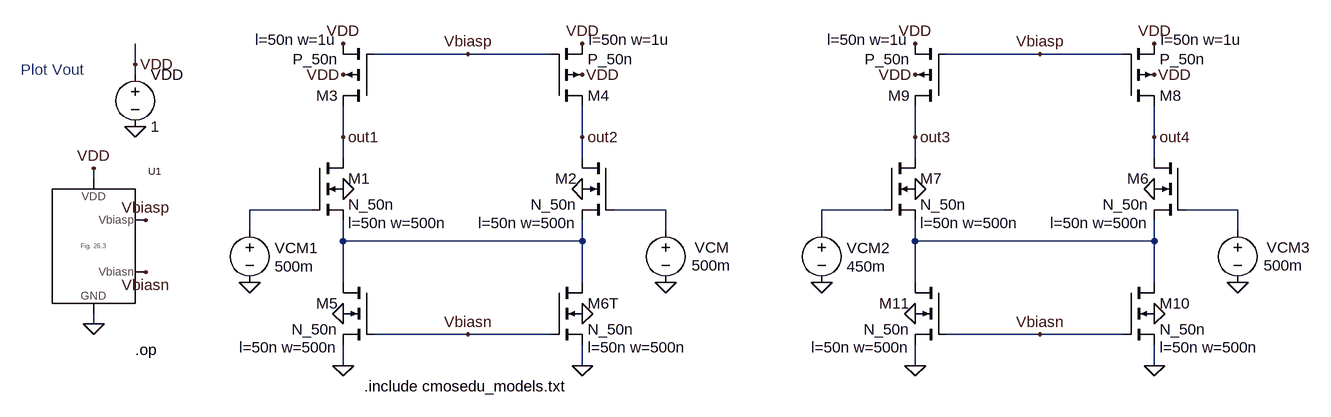
[diagram p0: schematic Fig26_6.asc]
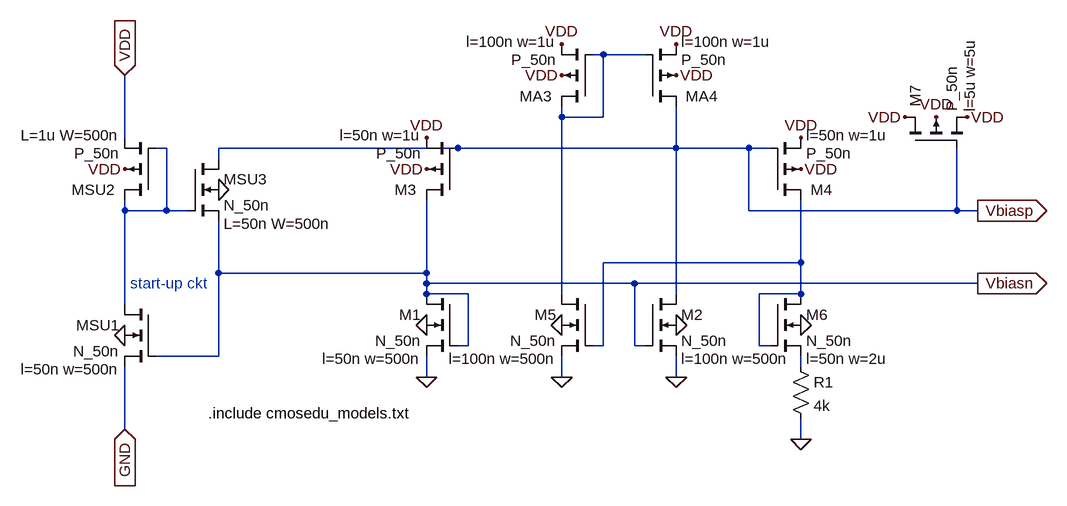
[diagram p1: sub-circuit fig_26_3.asc]
Fig26_6.asc, the LTspice schematic file:
Version 4
SHEET 1 2684 680
WIRE 1376 -368 1232 -368
WIRE 1504 -368 1376 -368
WIRE 2256 -368 2112 -368
WIRE 2384 -368 2256 -368
WIRE 864 -352 864 -384
WIRE 864 -336 864 -352
WIRE 1184 -240 1184 -288
WIRE 1552 -240 1552 -288
WIRE 2064 -240 2064 -288
WIRE 2432 -240 2432 -288
WIRE 1184 -208 1184 -240
WIRE 1552 -208 1552 -240
WIRE 2064 -208 2064 -240
WIRE 2432 -208 2432 -240
WIRE 800 -176 800 -192
WIRE 1136 -128 1040 -128
WIRE 1680 -128 1600 -128
WIRE 2016 -128 1920 -128
WIRE 2560 -128 2480 -128
WIRE 1040 -96 1040 -128
WIRE 1680 -96 1680 -128
WIRE 1920 -96 1920 -128
WIRE 2560 -96 2560 -128
WIRE 1184 -80 1184 -112
WIRE 1552 -80 1552 -112
WIRE 1552 -80 1184 -80
WIRE 2064 -80 2064 -112
WIRE 2432 -80 2432 -112
WIRE 2432 -80 2064 -80
WIRE 1184 -16 1184 -80
WIRE 1552 -16 1552 -80
WIRE 2064 -16 2064 -80
WIRE 2432 -16 2432 -80
WIRE 800 48 800 32
WIRE 1376 64 1232 64
WIRE 1504 64 1376 64
WIRE 2256 64 2112 64
WIRE 2384 64 2256 64
WIRE 1184 112 1184 80
WIRE 1552 112 1552 80
WIRE 2064 112 2064 80
WIRE 2432 112 2432 80
FLAG 864 -256 0
FLAG 864 -352 VDD
FLAG 1552 -160 0
FLAG 1552 112 0
FLAG 1184 -160 0
FLAG 1552 -384 VDD
FLAG 1552 -336 VDD
FLAG 1184 -336 VDD
FLAG 800 -192 VDD
FLAG 800 48 0
FLAG 1040 -16 0
FLAG 1184 -384 VDD
FLAG 1552 32 0
FLAG 1680 -16 0
FLAG 880 -32 Vbiasn
FLAG 880 -112 Vbiasp
FLAG 1184 112 0
FLAG 1184 32 0
FLAG 1376 64 Vbiasn
FLAG 1376 -368 Vbiasp
FLAG 1184 -240 out1
FLAG 1552 -240 out2
FLAG 2432 -160 0
FLAG 2432 112 0
FLAG 2064 -160 0
FLAG 2432 -384 VDD
FLAG 2432 -336 VDD
FLAG 2064 -336 VDD
FLAG 1920 -16 0
FLAG 2064 -384 VDD
FLAG 2432 32 0
FLAG 2560 -16 0
FLAG 2064 112 0
FLAG 2064 32 0
FLAG 2256 64 Vbiasn
FLAG 2256 -368 Vbiasp
FLAG 2064 -240 out3
FLAG 2432 -240 out4
SYMBOL voltage 864 -352 R0
WINDOW 123 0 0 Left 2
WINDOW 39 0 0 Left 2
SYMATTR InstName VDD
SYMATTR Value 1
SYMBOL nmos4 1600 -208 M0
WINDOW 123 56 100 Left 2
SYMATTR Value2 l=50n w=500n
SYMATTR InstName M2
SYMATTR Value N_50n
SYMBOL nmos4 1136 -208 R0
WINDOW 123 56 100 Left 2
SYMATTR Value2 l=50n w=500n
SYMATTR InstName M1
SYMATTR Value N_50n
SYMBOL pmos4 1504 -288 M180
WINDOW 123 58 102 Left 2
WINDOW 0 56 16 Left 2
SYMATTR Value2 l=50n w=1u
SYMATTR InstName M4
SYMATTR Value P_50n
SYMBOL pmos4 1232 -288 R180
WINDOW 123 58 102 Left 2
WINDOW 0 56 16 Left 2
SYMATTR Value2 l=50n w=1u
SYMATTR InstName M3
SYMATTR Value P_50n
SYMBOL voltage 1040 -112 R0
WINDOW 0 39 43 Left 2
WINDOW 123 38 75 Left 2
WINDOW 39 0 0 Left 2
WINDOW 3 39 71 Left 2
SYMATTR InstName VCM1
SYMATTR Value 500m
SYMBOL nmos4 1504 -16 R0
WINDOW 123 56 100 Left 2
SYMATTR Value2 l=50n w=500n
SYMATTR InstName M6T
SYMATTR Value N_50n
SYMBOL voltage 1680 -112 R0
WINDOW 0 45 42 Left 2
WINDOW 3 40 70 Left 2
WINDOW 123 0 0 Left 2
WINDOW 39 0 0 Left 2
SYMATTR InstName VCM
SYMATTR Value 500m
SYMBOL Fig_26_3 736 -64 R0
SYMATTR InstName U1
SYMBOL nmos4 1232 -16 M0
WINDOW 123 56 100 Left 2
SYMATTR Value2 l=50n w=500n
SYMATTR InstName M5
SYMATTR Value N_50n
SYMBOL nmos4 2480 -208 M0
WINDOW 123 56 100 Left 2
SYMATTR Value2 l=50n w=500n
SYMATTR InstName M6
SYMATTR Value N_50n
SYMBOL nmos4 2016 -208 R0
WINDOW 123 56 100 Left 2
SYMATTR Value2 l=50n w=500n
SYMATTR InstName M7
SYMATTR Value N_50n
SYMBOL pmos4 2384 -288 M180
WINDOW 123 58 102 Left 2
WINDOW 0 56 16 Left 2
SYMATTR Value2 l=50n w=1u
SYMATTR InstName M8
SYMATTR Value P_50n
SYMBOL pmos4 2112 -288 R180
WINDOW 123 58 102 Left 2
WINDOW 0 56 16 Left 2
SYMATTR Value2 l=50n w=1u
SYMATTR InstName M9
SYMATTR Value P_50n
SYMBOL voltage 1920 -112 R0
WINDOW 0 39 43 Left 2
WINDOW 123 38 75 Left 2
WINDOW 39 0 0 Left 2
WINDOW 3 39 71 Left 2
SYMATTR InstName VCM2
SYMATTR Value 450m
SYMBOL nmos4 2384 -16 R0
WINDOW 123 56 100 Left 2
SYMATTR Value2 l=50n w=500n
SYMATTR InstName M10
SYMATTR Value N_50n
SYMBOL voltage 2560 -112 R0
WINDOW 0 45 42 Left 2
WINDOW 3 40 70 Left 2
WINDOW 123 0 0 Left 2
WINDOW 39 0 0 Left 2
SYMATTR InstName VCM3
SYMATTR Value 500m
SYMBOL nmos4 2112 -16 M0
WINDOW 123 56 100 Left 2
SYMATTR Value2 l=50n w=500n
SYMATTR InstName M11
SYMATTR Value N_50n
TEXT 1216 144 Left 2 !.include cmosedu_models.txt
TEXT 688 -344 Left 2 ;Plot Vout
TEXT 864 88 Left 2 !.op

fig_26_3.asc, the sub-circuit schematic file:
Version 4
SHEET 1 2004 680
WIRE 1280 -304 1264 -304
WIRE 1344 -304 1280 -304
WIRE 1216 -208 1216 -224
WIRE 1280 -208 1280 -304
WIRE 1280 -208 1216 -208
WIRE 544 -176 544 -272
WIRE 608 -160 592 -160
WIRE 1056 -160 688 -160
WIRE 1392 -160 1392 -224
WIRE 1392 -160 1056 -160
WIRE 1504 -160 1392 -160
WIRE 1536 -160 1504 -160
WIRE 688 -144 688 -160
WIRE 544 -64 544 -80
WIRE 608 -64 608 -160
WIRE 608 -64 544 -64
WIRE 640 -64 608 -64
WIRE 1504 -64 1504 -160
WIRE 1824 -64 1824 -160
WIRE 1824 -64 1504 -64
WIRE 1856 -64 1824 -64
WIRE 1584 16 1584 -80
WIRE 1584 16 1280 16
WIRE 688 32 688 -48
WIRE 1008 32 1008 -80
WIRE 1008 32 688 32
WIRE 1008 48 1008 32
WIRE 1328 48 1008 48
WIRE 1856 48 1328 48
WIRE 1008 64 1008 48
WIRE 1072 64 1008 64
WIRE 1216 64 1216 -208
WIRE 1392 64 1392 -160
WIRE 1584 64 1584 16
WIRE 1584 64 1520 64
WIRE 544 80 544 -64
WIRE 1072 144 1072 64
WIRE 1072 144 1056 144
WIRE 1280 144 1280 16
WIRE 1280 144 1264 144
WIRE 1328 144 1328 48
WIRE 1344 144 1328 144
WIRE 1520 144 1520 64
WIRE 1536 144 1520 144
WIRE 688 160 688 32
WIRE 688 160 592 160
WIRE 1584 176 1584 160
WIRE 1008 192 1008 160
WIRE 1216 192 1216 160
WIRE 1392 192 1392 160
WIRE 544 272 544 176
WIRE 1584 288 1584 256
FLAG 544 -128 VDD
FLAG 1008 -128 VDD
FLAG 1008 -176 VDD
FLAG 1584 -128 VDD
FLAG 1584 -176 VDD
FLAG 1584 288 0
FLAG 1584 112 0
FLAG 1392 -272 VDD
FLAG 1392 -320 VDD
FLAG 1216 -272 VDD
FLAG 1216 -320 VDD
FLAG 1392 112 0
FLAG 1792 -208 VDD
FLAG 1744 -208 VDD
FLAG 1840 -208 VDD
FLAG 544 -272 VDD
IOPIN 544 -272 In
FLAG 544 272 GND
IOPIN 544 272 In
FLAG 688 -96 0
FLAG 544 128 0
FLAG 1008 192 0
FLAG 1008 112 0
FLAG 1216 112 0
FLAG 1216 192 0
FLAG 1392 192 0
FLAG 1856 -64 Vbiasp
IOPIN 1856 -64 Out
FLAG 1856 48 Vbiasn
IOPIN 1856 48 Out
SYMBOL pmos4 592 -80 R180
WINDOW 0 63 16 Left 2
WINDOW 123 56 100 Left 2
SYMATTR InstName MSU2
SYMATTR Value2 L=1u W=500n
SYMATTR Value P_50n
SYMBOL nmos4 592 80 M0
WINDOW 123 56 100 Left 2
SYMATTR Value2 l=50n w=500n
SYMATTR InstName MSU1
SYMATTR Value N_50n
SYMBOL nmos4 640 -144 R0
WINDOW 123 56 100 Left 2
SYMATTR Value2 L=50n W=500n
SYMATTR InstName MSU3
SYMATTR Value N_50n
SYMBOL pmos4 1056 -80 R180
WINDOW 0 63 16 Left 2
WINDOW 123 56 100 Left 2
SYMATTR InstName M3
SYMATTR Value2 l=50n w=1u
SYMATTR Value P_50n
SYMBOL pmos4 1536 -80 M180
WINDOW 0 63 16 Left 2
WINDOW 123 56 100 Left 2
SYMATTR InstName M4
SYMATTR Value2 l=50n w=1u
SYMATTR Value P_50n
SYMBOL nmos4 1056 64 M0
WINDOW 123 56 100 Left 2
SYMATTR Value2 l=50n w=500n
SYMATTR InstName M1
SYMATTR Value N_50n
SYMBOL res 1568 160 R0
SYMATTR InstName R1
SYMATTR Value 4k
SYMBOL pmos4 1344 -224 M180
WINDOW 0 63 16 Left 2
WINDOW 123 56 100 Left 2
SYMATTR InstName MA4
SYMATTR Value2 l=100n w=1u
SYMATTR Value P_50n
SYMBOL pmos4 1264 -224 R180
WINDOW 0 63 16 Left 2
WINDOW 123 56 100 Left 2
SYMATTR InstName MA3
SYMATTR Value2 l=100n w=1u
SYMATTR Value P_50n
SYMBOL nmos4 1264 64 M0
WINDOW 123 56 100 Left 2
SYMATTR Value2 l=100n w=500n
SYMATTR InstName M5
SYMATTR Value N_50n
SYMBOL pmos4 1744 -160 R270
WINDOW 0 63 16 Left 2
WINDOW 123 56 100 Left 2
SYMATTR InstName M7
SYMATTR Value2 l=5u w=5u
SYMATTR Value P_50n
SYMBOL nmos4 1344 64 R0
WINDOW 123 56 100 Left 2
SYMATTR Value2 l=100n w=500n
SYMATTR InstName M2
SYMATTR Value N_50n
SYMBOL nmos4 1536 64 R0
WINDOW 123 56 100 Left 2
SYMATTR Value2 l=50n w=2u
SYMATTR InstName M6
SYMATTR Value N_50n
TEXT 552 48 Left 2 ;start-up ckt
TEXT 672 248 Left 2 !.include cmosedu_models.txt

The netlist it stands for:
* Fig26_6.asc
VDD VDD 0 1
M2 out2 N002 N005 0 N_50n l=50n w=500n
M1 out1 N001 N005 0 N_50n l=50n w=500n
M4 out2 Vbiasp VDD VDD P_50n l=50n w=1u
M3 out1 Vbiasp VDD VDD P_50n l=50n w=1u
VCM1 N001 0 500m
M6T N005 Vbiasn 0 0 N_50n l=50n w=500n
VCM N002 0 500m
XU1 Vbiasn Vbiasp VDD 0 fig_26_3
M5 N005 Vbiasn 0 0 N_50n l=50n w=500n
M6 out4 N004 N006 0 N_50n l=50n w=500n
M7 out3 N003 N006 0 N_50n l=50n w=500n
M8 out4 Vbiasp VDD VDD P_50n l=50n w=1u
M9 out3 Vbiasp VDD VDD P_50n l=50n w=1u
VCM2 N003 0 450m
M10 N006 Vbiasn 0 0 N_50n l=50n w=500n
VCM3 N004 0 500m
M11 N006 Vbiasn 0 0 N_50n l=50n w=500n

* block symbol definitions
.subckt fig_26_3 Vbiasn Vbiasp VDD GND
MSU2 N002 N002 VDD VDD P_50n L=1u W=500n
MSU1 N002 Vbiasn GND 0 N_50n l=50n w=500n
MSU3 Vbiasp N002 Vbiasn 0 N_50n L=50n W=500n
M3 Vbiasn Vbiasp VDD VDD P_50n l=50n w=1u
M4 N003 Vbiasp VDD VDD P_50n l=50n w=1u
M1 Vbiasn Vbiasn 0 0 N_50n l=50n w=500n
R1 N004 0 4k
MA4 Vbiasp N001 VDD VDD P_50n l=100n w=1u
MA3 N001 N001 VDD VDD P_50n l=100n w=1u
M5 N001 N003 0 0 N_50n l=100n w=500n
M7 VDD Vbiasp VDD VDD P_50n l=5u w=5u
M2 Vbiasp Vbiasn 0 0 N_50n l=100n w=500n
M6 N003 N003 N004 0 N_50n l=50n w=2u
* start-up ckt
.include cmosedu_models.txt
.ends fig_26_3

.model NMOS NMOS
.model PMOS PMOS
.lib standard.mos
.include cmosedu_models.txt
* Plot Vout
.op
.backanno
.end